# Altium schematic sheet Connector.SchDoc
size A4; SheetNumber: 7; SheetTotal: 7
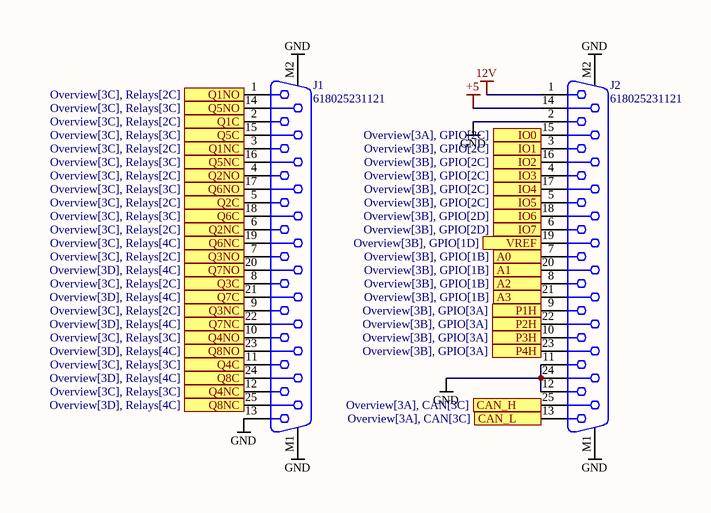
[diagram p0: Connector.SchDoc]

## Parts
J1  618025231121  [618025231121]
J2  618025231121  [618025231121]

## Ports
A0 (see Overview[3B], GPIO[1B]), A1 (see Overview[3B], GPIO[1B]), A2 (see Overview[3B], GPIO[1B]), A3 (see Overview[3B], GPIO[1B]), CAN_H (see Overview[3A], CAN[3C]), CAN_L (see Overview[3A], CAN[3C]), IO0 (see Overview[3A], GPIO[2C]), IO1 (see Overview[3B], GPIO[2C]), IO2 (see Overview[3B], GPIO[2C]), IO3 (see Overview[3B], GPIO[2C]), IO4 (see Overview[3B], GPIO[2C]), IO5 (see Overview[3B], GPIO[2C]), IO6 (see Overview[3B], GPIO[2D]), IO7 (see Overview[3B], GPIO[2D]), P1H (see Overview[3B], GPIO[3A]), P2H (see Overview[3B], GPIO[3A]), P3H (see Overview[3B], GPIO[3A]), P4H (see Overview[3B], GPIO[3A]), Q1C (see Overview[3C], Relays[2C]), Q1NC (see Overview[3C], Relays[2C]), Q1NO (see Overview[3C], Relays[2C]), Q2C (see Overview[3C], Relays[2C]), Q2NC (see Overview[3C], Relays[2C]), Q2NO (see Overview[3C], Relays[2C]), Q3C (see Overview[3C], Relays[2C]), Q3NC (see Overview[3C], Relays[2C]), Q3NO (see Overview[3C], Relays[2C]), Q4C (see Overview[3C], Relays[3C]), Q4NC (see Overview[3C], Relays[3C]), Q4NO (see Overview[3C], Relays[3C]), Q5C (see Overview[3C], Relays[3C]), Q5NC (see Overview[3C], Relays[3C]), Q5NO (see Overview[3C], Relays[3C]), Q6C (see Overview[3C], Relays[3C]), Q6NC (see Overview[3C], Relays[4C]), Q6NO (see Overview[3C], Relays[3C]), Q7C (see Overview[3D], Relays[4C]), Q7NC (see Overview[3D], Relays[4C]), Q7NO (see Overview[3D], Relays[4C]), Q8C (see Overview[3D], Relays[4C]), Q8NC (see Overview[3D], Relays[4C]), Q8NO (see Overview[3D], Relays[4C]), VREF (see Overview[3B], GPIO[1D])

## Nets
12V: J2.1
+5: J2.14
GND: J1.13 J1.M1 J1.M2 J2.2 J2.11 J2.12 J2.24 J2.M1 J2.M2
A0: J2.7 ; port A0
A1: J2.20 ; port A1
A2: J2.8 ; port A2
A3: J2.21 ; port A3
CAN_H: J2.25 ; port CAN_H
CAN_L: J2.13 ; port CAN_L
IO0: J2.15 ; port IO0
IO1: J2.3 ; port IO1
IO2: J2.16 ; port IO2
IO3: J2.4 ; port IO3
IO4: J2.17 ; port IO4
IO5: J2.5 ; port IO5
IO6: J2.18 ; port IO6
IO7: J2.6 ; port IO7
P1H: J2.9 ; port P1H
P2H: J2.22 ; port P2H
P3H: J2.10 ; port P3H
P4H: J2.23 ; port P4H
Q1C: J1.2 ; port Q1C
Q1NC: J1.3 ; port Q1NC
Q1NO: J1.1 ; port Q1NO
Q2C: J1.5 ; port Q2C
Q2NC: J1.6 ; port Q2NC
Q2NO: J1.4 ; port Q2NO
Q3C: J1.8 ; port Q3C
Q3NC: J1.9 ; port Q3NC
Q3NO: J1.7 ; port Q3NO
Q4C: J1.11 ; port Q4C
Q4NC: J1.12 ; port Q4NC
Q4NO: J1.10 ; port Q4NO
Q5C: J1.15 ; port Q5C
Q5NC: J1.16 ; port Q5NC
Q5NO: J1.14 ; port Q5NO
Q6C: J1.18 ; port Q6C
Q6NC: J1.19 ; port Q6NC
Q6NO: J1.17 ; port Q6NO
Q7C: J1.21 ; port Q7C
Q7NC: J1.22 ; port Q7NC
Q7NO: J1.20 ; port Q7NO
Q8C: J1.24 ; port Q8C
Q8NC: J1.25 ; port Q8NC
Q8NO: J1.23 ; port Q8NO
VREF: J2.19 ; port VREF

## Library data of the parts
J1 J2 = CMP-1502-00202-2: NexarPartId: 18818207; Pitch: 2.77mm; Operating Supply Voltage: 125V; Gender: Female; Insulation Resistance: 5GΩ; Contact Resistance: 30mΩ; Current Rating: 3A; Number of Contacts: 25; Contact Plating: Gold; Width: 12.5mm; RoHS: Compliant; REACH SVHC: Unknown; Min Operating Temperature: -55°C; Termination: SMD/SMT; Voltage Rating: 125V; Mount: Through Hole; Housing Material: Steel; Insulation Material: PBT; Number of Rows: 2; Depth: 18.5mm; Orientation: Right Angle; Number of Pins: 25; Max Operating Temperature: 105°C; Length: 38.33mm